# Altium project PLASMA_Project.PrjPcb
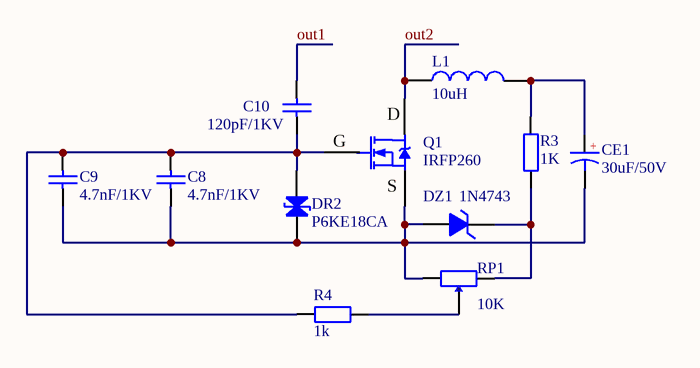
[diagram p0: PLASMA.SchDoc]
1 sheet, 11 parts. Net scope: global (net labels, ports and power ports of the same name join across sheets).
Board file: PCB1.PcbDoc

## Sheet PLASMA.SchDoc
size A4; SheetNumber: 1; SheetTotal: 1

### Parts
C8  4.7nF/1KV  [CY 7.5*10*4]
C9  4.7nF/1KV  [CY 7.5*10*4]
C10  120pF/1KV  [CY 7.5*10*4]
CE1  30uF/50V  [CE-3.5*8]
DR2  P6KE18CA  [DO-15]
DZ1  1N4743  [DO-41]
L1  10uH  [AL0510]
Q1  IRFP260  [TO247A]
R3  1K  [RS 2W]
R4  1k  [RS 2W]
RP1  10K  [3296W]

### Nets
out1: C10.2
out2: L1.1 Q1.2(D)
NetC8_1: C8.1 C9.1 CE1.2 DR2.2(K) DZ1.1(A) Q1.3(S) RP1.3
NetC8_2: C8.2 C9.2 C10.1 DR2.1(A) Q1.1(G) R4.1
NetCE1_1: CE1.1 L1.2 R3.2
NetDZ1_2: DZ1.2(K) R3.1 RP1.1
NetR4_2: R4.2 RP1.2

### Notes on the sheet
- (in symbol CE) +

### Library data of the parts
C8-C10 = CY: 安规Y电容; BOM名称: 高压陶瓷电容，Y电容; 当前库版本V2024.2.3 @淘宝卖家:黄晶宝石: 最新版本发布https://item.taobao.com/item.htm?id=566775463719
CE1 = CE: 直插电解电容; 联系下单店铺卖家 免费帮你查找封装: 联系下单店铺卖家 免费技术指导; BOM名称: 直插电解电容
DR2 = DR: 瞬态电压抑制二极管; 当前库版本V2024.2.3 @淘宝卖家:黄晶宝石: 最新版本发布https://item.taobao.com/item.htm?id=566775463719; BOM名称: 瞬态电压抑制二极管
DZ1 = 1N4742: 12V/1W稳压管; 当前库版本V2024.2.3 @淘宝卖家:黄晶宝石: 最新版本发布https://item.taobao.com/item.htm?id=566775463719; BOM名称: 12V/1W稳压管
L1 = L-AL: 色环电感; 当前库版本V2024.2.3 @淘宝卖家:黄晶宝石: 最新版本发布https://item.taobao.com/item.htm?id=566775463719; BOM名称: 色环电感
Q1 = IRFP250: N沟道 200V/30A; BOM名称: 功率型N沟场效应管; 联系下单店铺卖家 免费帮你查找封装: 联系下单店铺卖家 免费技术支持; 当前库版本V2024.2.3 @淘宝卖家:黄晶宝石: 最新版本发布https://item.taobao.com/item.htm?id=566775463719
R3 R4 = R-DIP: 直插色环电阻; BOM名称: 色环电阻; 联系下单店铺卖家 免费帮你查找封装: 联系下单店铺卖家 免费技术指导
RP1 = RP: 单联电位器; BOM名称: 插件电位器; 联系下单店铺卖家 免费帮你查找封装: 联系下单店铺卖家 免费技术指导